# Altium project infrarrojo pulsante.PrjPcb
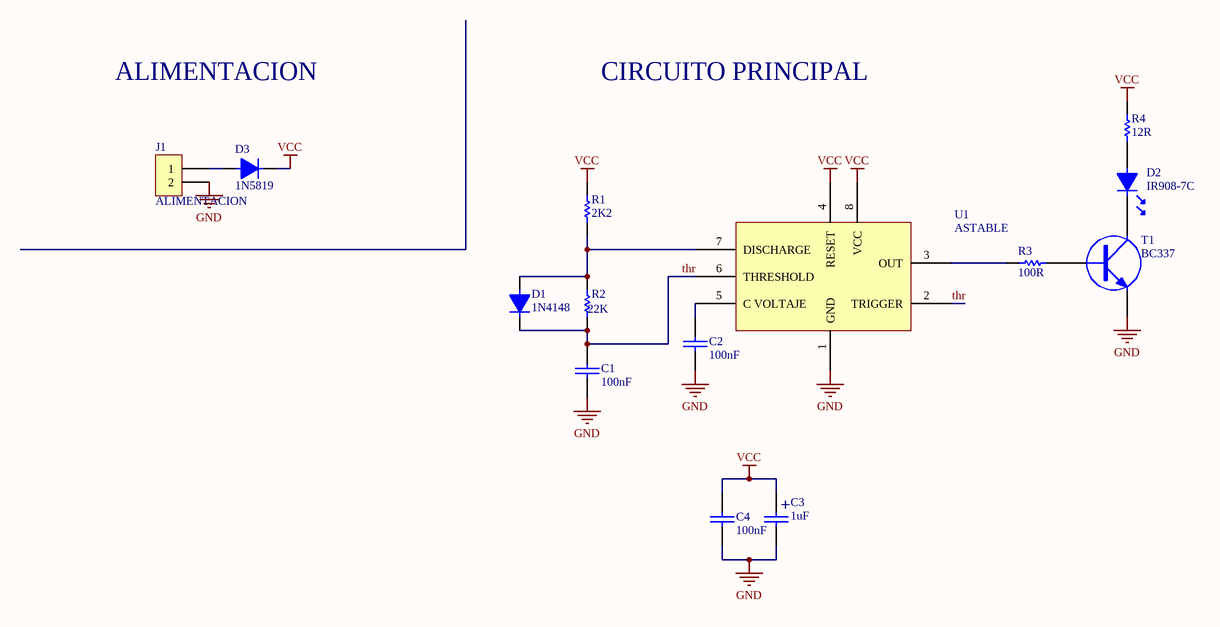
[diagram p0: ESQUEMATICO.SchDoc]
1 sheet, 14 parts. Net scope: global (net labels, ports and power ports of the same name join across sheets).
Board files: PCB.PcbDoc, PANEL.PcbDoc

## Sheet ESQUEMATICO.SchDoc: Barrera Pulsante: emisor
size A4; DrawnBy: G8; Address1: Yapeyú 197; Address2: Almagro; Address3: CABA; Address4: Argentina; DocumentNumber: .; Revision: 1.0; SheetNumber: 1; SheetTotal: 1

### Parts
C1  100nF  [CAP100]
C2  100nF  [CAP200]
C3  1uF  [CAP100RP]
C4  100nF  [CAP200]
D1  1N4148  [DO41]
D2  IR908-7C  [fotodiodo]
D3  1N5819  [DO41]
J1  ALIMENTACION  [BORNERA2]
R1  2K2  [RES400]
R2  22K  [RES400]
R3  100R  [RES400]
R4  12R  [RES400]
T1  BC337  [TO92]
U1  ASTABLE  [DIP8]

### Nets
GND: C1.2 C2.2 C3.2 C4.2 J1.2 T1.3(E) U1.1(GND)
VCC: C3.1 C4.1 D3.2 R1.1 R4.1 U1.4(RESET) U1.8(VCC)
thr: C1.1 D1.2 R2.1 U1.2(TRIGGER) U1.6(THRESHOLD)
NetC2_1: C2.1 U1.5(C_VOLTAJE)
NetD1_1: D1.1 R1.2 R2.2 U1.7(DISCHARGE)
NetD2_1: D2.1 R4.2
NetD2_2: D2.2 T1.2(C)
NetD3_1: D3.1 J1.1
NetR3_1: R3.1 U1.3(OUT)
NetR3_2: R3.2 T1.1(B)

### Notes on the sheet
- ALIMENTACION
- CIRCUITO PRINCIPAL
- Title
- Size:
- Date:
- A4
- Number:
- Time:
- Revision:
- Sheet
- of
- File:
- (in symbol CAPPOL) +

### Library data of the parts
C1 C2 C4 = CAP
C3 = CAPPOL
D1 D3 = DIODO
D2 = IR908-7C: Led infrarrojo
J1 = BORNERA 2
R1-R4 = RES
T1 = TRANSISTOR NPN
U1 = LM555: Timer